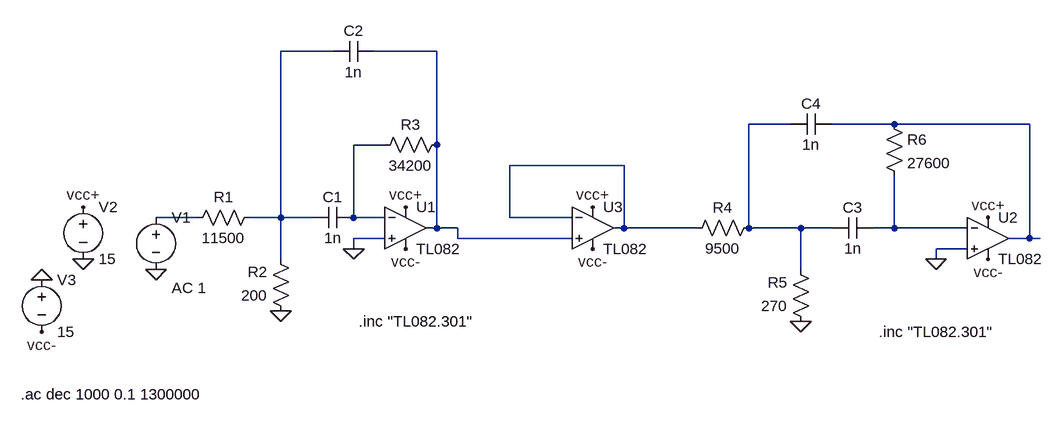
[diagram p0: schematic Simulacion_comun.asc]
Simulacion_comun.asc, the LTspice schematic file:
Version 4
SHEET 1 936 680
WIRE -160 -80 -240 -80
WIRE 0 -80 -96 -80
WIRE 544 32 480 32
WIRE 704 32 608 32
WIRE 912 32 704 32
WIRE -80 64 -128 64
WIRE 0 64 0 -80
WIRE 288 96 112 96
WIRE -368 176 -432 176
WIRE -240 176 -240 -80
WIRE -240 176 -288 176
WIRE -192 176 -240 176
WIRE -128 176 -128 64
WIRE -80 176 -128 176
WIRE 112 176 112 96
WIRE 208 176 112 176
WIRE 0 192 0 64
WIRE 0 192 -16 192
WIRE 32 192 0 192
WIRE 288 192 288 96
WIRE 288 192 272 192
WIRE 400 192 288 192
WIRE 480 192 480 32
WIRE 560 192 480 192
WIRE 608 192 560 192
WIRE 704 192 704 112
WIRE 704 192 672 192
WIRE 816 192 704 192
WIRE -80 208 -128 208
WIRE 32 208 32 192
WIRE 208 208 32 208
WIRE 912 208 912 32
WIRE 912 208 880 208
WIRE 928 208 912 208
WIRE -128 224 -128 208
WIRE 816 224 768 224
WIRE -240 240 -240 176
WIRE 768 240 768 224
WIRE 560 256 560 192
FLAG -128 224 0
FLAG -240 320 0
FLAG -432 256 0
FLAG -48 160 vcc+
FLAG -48 224 vcc-
FLAG -544 240 0
FLAG -608 272 0
FLAG -544 160 vcc+
FLAG -608 352 vcc-
FLAG 768 240 0
FLAG 560 336 0
FLAG 848 176 vcc+
FLAG 848 240 vcc-
FLAG 240 160 vcc+
FLAG 240 224 vcc-
SYMBOL res -272 160 R90
WINDOW 0 0 56 VBottom 2
WINDOW 3 32 56 VTop 2
SYMATTR InstName R1
SYMATTR Value 11500
SYMBOL res -224 336 R180
WINDOW 0 36 76 Left 2
WINDOW 3 36 40 Left 2
SYMATTR InstName R2
SYMATTR Value 200
SYMBOL res -96 80 R270
WINDOW 0 32 56 VTop 2
WINDOW 3 0 56 VBottom 2
SYMATTR InstName R3
SYMATTR Value 34200
SYMBOL cap -128 160 R90
WINDOW 0 0 32 VBottom 2
WINDOW 3 32 32 VTop 2
SYMATTR InstName C1
SYMATTR Value 1n
SYMBOL cap -96 -96 R90
WINDOW 0 0 32 VBottom 2
WINDOW 3 32 32 VTop 2
SYMATTR InstName C2
SYMATTR Value 1n
SYMBOL Opamps\\opamp2 -48 128 R0
SYMATTR InstName U1
SYMATTR Value TL082
SYMBOL voltage -432 160 R0
WINDOW 123 24 124 Left 2
WINDOW 39 0 0 Left 2
SYMATTR Value2 AC 1
SYMATTR InstName V1
SYMATTR Value ""
SYMBOL voltage -544 144 R0
SYMATTR InstName V2
SYMATTR Value 15
SYMBOL voltage -608 256 R0
SYMATTR InstName V3
SYMATTR Value 15
SYMBOL res 496 176 R90
WINDOW 0 0 56 VBottom 2
WINDOW 3 32 56 VTop 2
SYMATTR InstName R4
SYMATTR Value 9500
SYMBOL res 576 352 R180
WINDOW 0 36 76 Left 2
WINDOW 3 36 40 Left 2
SYMATTR InstName R5
SYMATTR Value 270
SYMBOL res 688 16 R0
SYMATTR InstName R6
SYMATTR Value 27600
SYMBOL cap 672 176 R90
WINDOW 0 0 32 VBottom 2
WINDOW 3 32 32 VTop 2
SYMATTR InstName C3
SYMATTR Value 1n
SYMBOL cap 608 16 R90
WINDOW 0 0 32 VBottom 2
WINDOW 3 32 32 VTop 2
SYMATTR InstName C4
SYMATTR Value 1n
SYMBOL Opamps\\opamp2 848 144 R0
SYMATTR InstName U2
SYMATTR Value TL082
SYMBOL Opamps\\opamp2 240 128 R0
SYMATTR InstName U3
SYMATTR Value TL082
TEXT -120 336 Left 2 !.inc "TL082.301"
TEXT -640 448 Left 2 !.ac dec 1000 0.1 1300000
TEXT 680 352 Left 2 !.inc "TL082.301"

The netlist it stands for:
* Simulacion_comun.asc
R1 N001 N007 11500
R2 0 N001 200
R3 N005 N002 34200
C1 N005 N001 1n
C2 N002 N001 1n
XU1 0 N005 vcc+ vcc- N002 TL082  ; pins In+ In- V+ V- OUT
V1 N007 0 AC 1
V2 vcc+ 0 15
V3 0 vcc- 15
R4 N003 N006 9500
R5 0 N003 270
R6 N004 N008 27600
C3 N008 N003 1n
C4 N004 N003 1n
XU2 0 N008 vcc+ vcc- N004 TL082  ; pins In+ In- V+ V- OUT
XU3 N002 N006 vcc+ vcc- N006 TL082  ; pins In+ In- V+ V- OUT
.inc "TL082.301"
.ac dec 1000 0.1 1300000
.inc "TL082.301"
.backanno
.end